# Altium schematic sheet Regulator.SchDoc
size A; SheetNumber: 5; SheetTotal: 6
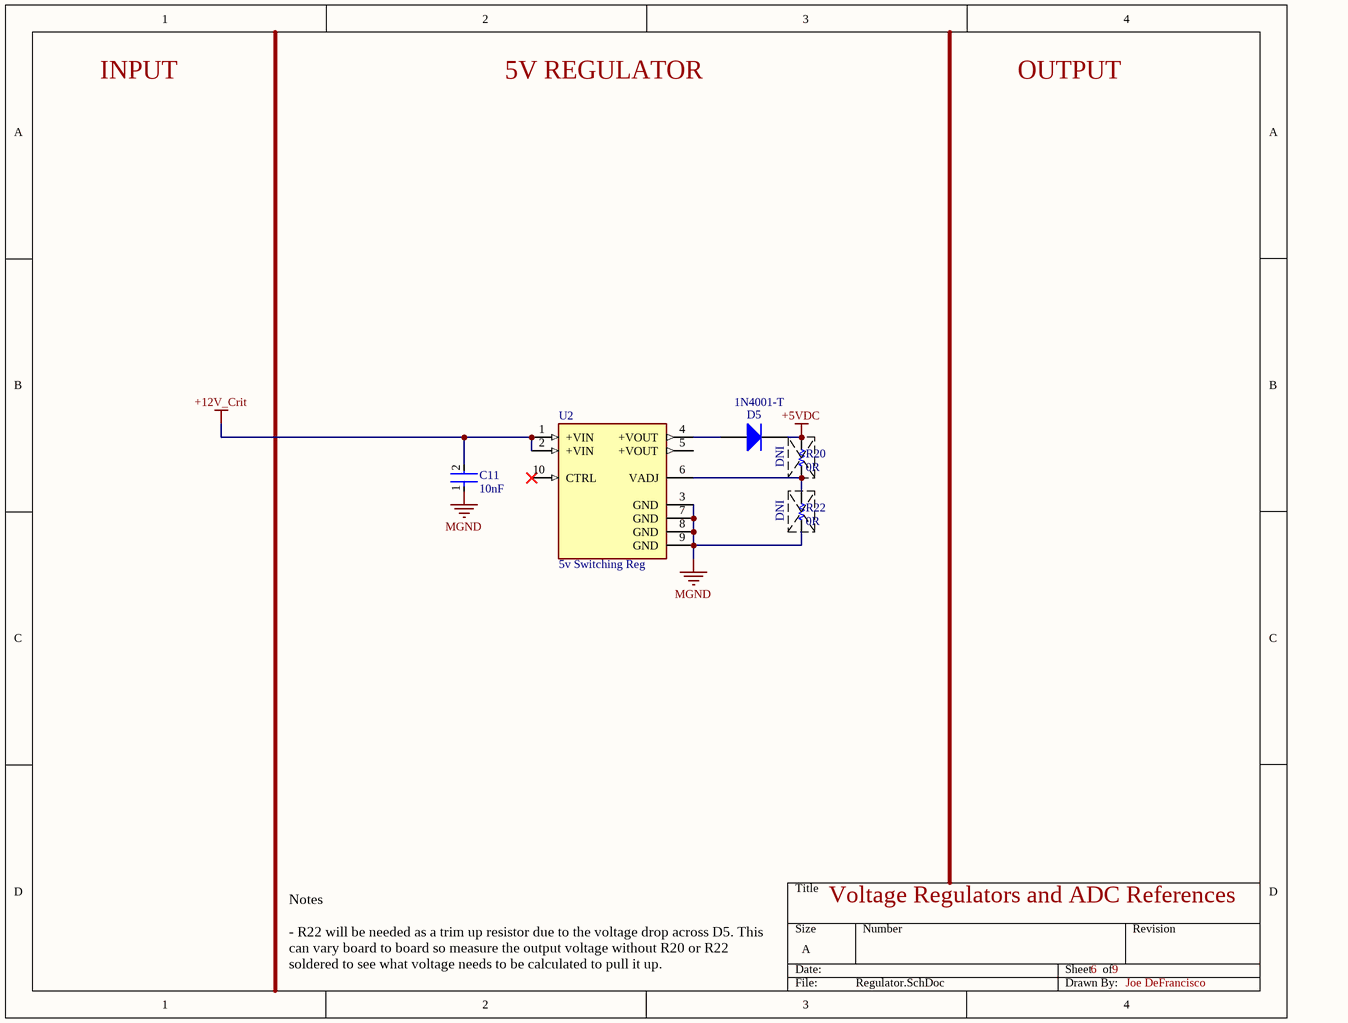
[diagram p0: Regulator.SchDoc]

## Parts
(Parts that share a designator on the sheet are numbered #1, #2 ... from top to bottom, then left to right.)
C11  Capacitance: 10nF  [FP-CGA3E-0_3-0_1-IPC_A]  (hidden comment: CGA3E2X8R2A103K080AD)
D5  1N4001-T  [DIOD-DO-41-P-2_V]
DNI??#1  DO NOT INSTALL  (value not drawn)  (graphical)
DNI??#2  DO NOT INSTALL  (value not drawn)  (graphical)
R20  SchematicInformation: 0R  [R_0603]  (hidden comment: RES_0R_1%_0603)
R22  SchematicInformation: 0R  [R_0603]  (hidden comment: RES_0R_1%_0603)
U2  5v Switching Reg  [5v Reg]

## Nets
+5VDC: D5.2(K) R20.2
+12V_Crit: C11.2 U2.1(+VIN) U2.2(+VIN)
MGND: C11.1 R22.1 U2.3(GND) U2.7(GND) U2.8(GND) U2.9(GND)
NetD5_1: D5.1(A) U2.4(+VOUT)
NetR20_1: R20.1 R22.2 U2.6(VADJ)

Not connected (* = marked no-connect by the designer): U2 5(+VOUT) 10(CTRL)*

## Notes on the sheet
- INPUT
- 5V REGULATOR
- OUTPUT
- Voltage Regulators and ADC References
- Notes
  - R22 will be needed as a trim up resistor due to the voltage drop across D5. This can vary board to board so measure the output voltage without R20 or R22 soldered to see what voltage needs to be calculated to pull it up.
- 6
- 9
- Joe DeFrancisco

## Library data of the parts
C11 = CMP-08246-000769-1: Cap Ceramic 10nF 100V X8R 10% Pad SMD 0603 +150°C Automotive T/R; Mount: Surface Mount; Voltage Rating (DC): 100V; Termination: SMD/SMT; Dielectric: X8R; Case/Package: 0603; Ratings: AEC-Q200; Voltage Rating: 100V; Packaging: Tape and Reel; Thickness: 0.035inch; Composition: Ceramic; Max Operating Temperature: 150°C; Width: 0.031inch; Height: 0.8mm; Weight: 7.1E-05oz; Depth: 0.8mm; Min Operating Temperature: -55°C; Length: 1.6mm; Case Code (Metric): 1608; Tolerance: 10%; Package Quantity: 4000; Case Code (Imperial): 0603
D5 = CMP-0639-00006-2: 1.0 A Rectifier, 15 pF, 50 V, -65 to 150 degC, 2-Pin DO-41 Plastic, RoHS, Tape and Reel; Manufacturer: Diodes Inc; VF (V): 1; CT (pF): 15; Max. IR (uA): 5; VRRM (V): 50; Max. IFSM (A): 30; RoHS: TRUE; Mounting Technology: Through Hole; PartNumber: 1N4001-T; ComponentLink2Description: Datasheet; DatasheetVersion: Rev. 8-2; Operating Temperature Range (degC): -65 to 150; Packing: Tape and Reel; PackageReference: DO-41-P-2; ComponentLink1URL: http://diodes.com/; PackageDescription: 2-Pin Axial Lead, Body 4.635 x 2.36 mm, Lead Spread 25.4 mm; ComponentLink2URL: http://diodes.com/datasheets/ds28002.pdf; Max. Average Rectified Current IO (A): 1; ComponentLink1Description: Manufacturer URL
DNI??#1 DNI??#2 = DNI
R20 R22 = RES_0R_1%_0603: Manufacturer Part Number: RC0603FR-070RL; Manufacturer: Yageo; DigiKey Part Number: 311-0.0HRCT-ND
U2 = 5v Switching Reg: 1A DC/DC-Converter 'INNOLINE' SMD reg; MF: Recom Power; MP: R-78AA5.0-1.0SMD-R; Value: *; Package: SMD-10 Recom Power; DigiKey-Purchase-URL: https://snapeda.com/shop?store=DigiKey&id=480105; SnapEDA_Link: https://www.snapeda.com/parts/R-78AA5.0-1.0SMD-R/Recom%20Power/view-part/480105/?ref=snap; Mouser-Purchase-URL: https://snapeda.com/shop?store=Mouser&id=480105; Digi-Key_Part_Number: 945-1044-1-ND; BuyPart: https://www.snapeda.com/parts/R-78AA5.0-1.0SMD-R/Recom%20Power/view-part/480105/?ref=eda; DigiKey: 945-1044-2-ND